# Altium schematic sheet yaokong.SchDoc
size A4
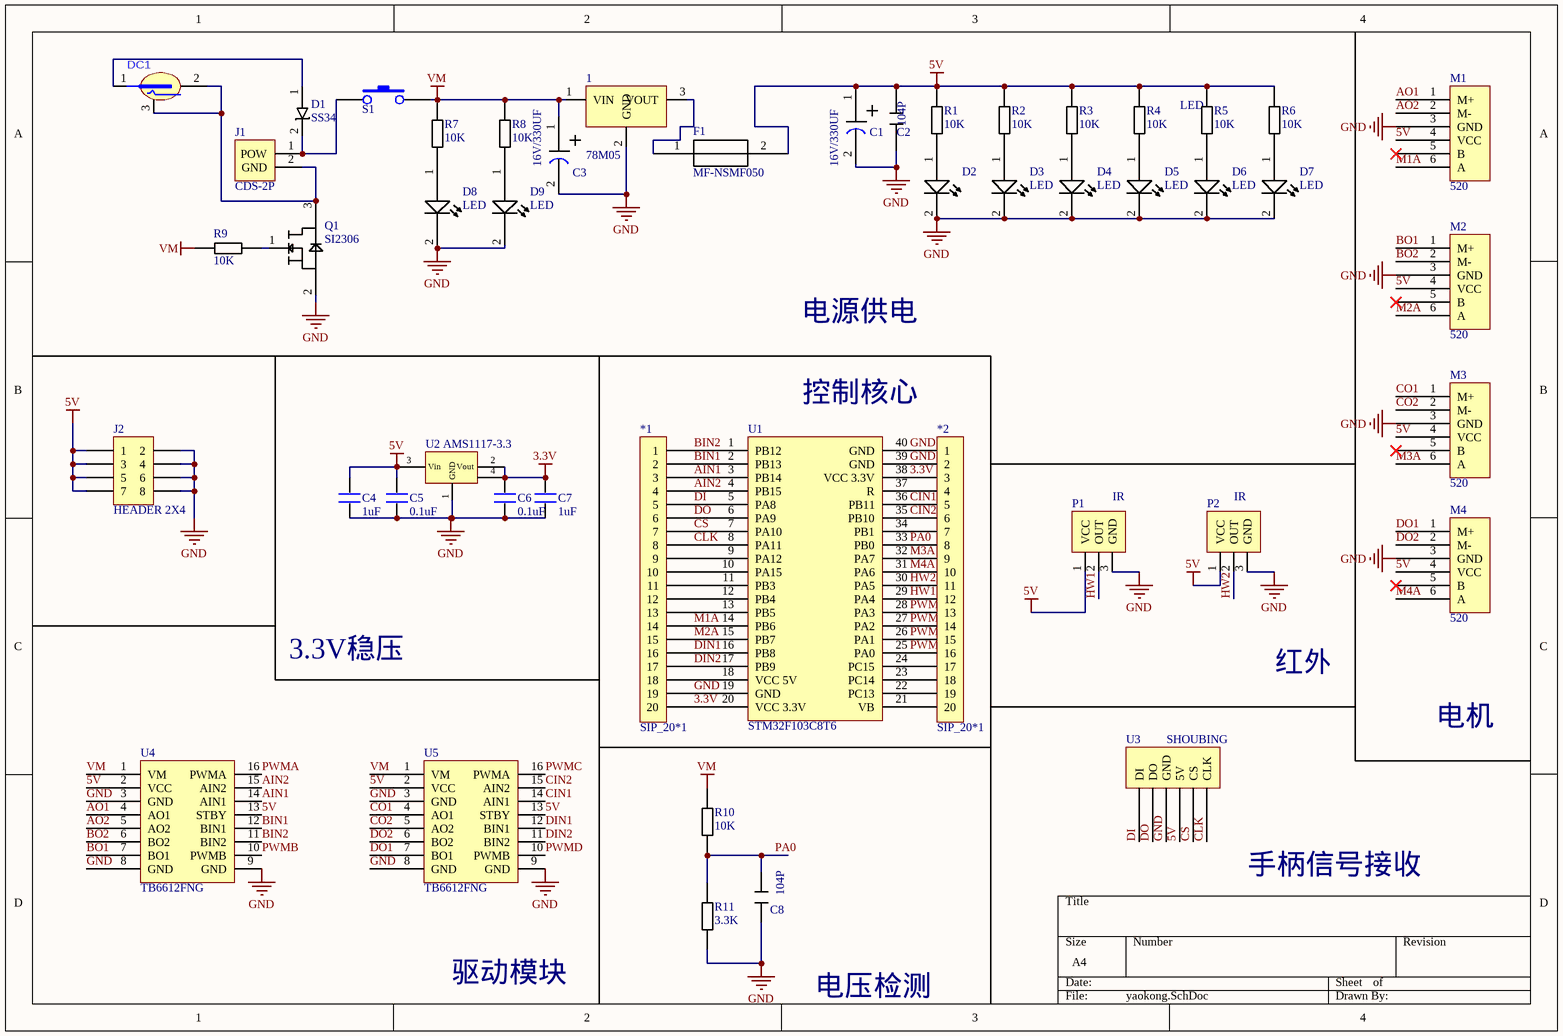
[diagram p0: yaokong.SchDoc]

## Parts
1  78M05  [78M05]
*1  SIP_20*1  [HEADER_20]
*2  SIP_20*1  [HEADER_20]
C1  16V/330UF  [ECAP]
C2  104P  [CAP]
C3  16V/330UF  [ECAP]
C4  1uF  [0603_棱丝印_2]
C5  0.1uF  [0603_棱丝印_2]
C6  0.1uF  [0603_棱丝印_2]
C7  1uF  [0603_棱丝印_2]
C8  104P  [CAP]
D1  SS34  [SS34]
D2  LED  [0603_棱丝印_2]
D3  LED  [0603_棱丝印_2]
D4  LED  [0603_棱丝印_2]
D5  LED  [0603_棱丝印_2]
D6  LED  [0603_棱丝印_2]
D7  LED  [0603_棱丝印_2]
D8  LED  [0603_棱丝印_2]
D9  LED  [0603_棱丝印_2]
DC1  DC005  [DC-IN_3P-DC-005-5A-3.0]  (value not drawn)
F1  MF-NSMF050  [MF]
J1  CDS-2P  [CDS-2P]
J2  HEADER 2X4  [HEADER2*4]
M1  520  [PH2.0-6P]
M2  520  [PH2.0-6P]
M3  520  [PH2.0-6P]
M4  520  [PH2.0-6P]
P1  IR  [HEADER3]
P2  IR  [HEADER3]
Q1  SI2306  [SI2306]
R1  10K  [0603_棱丝印_2]
R2  10K  [0603_棱丝印_2]
R3  10K  [0603_棱丝印_2]
R4  10K  [0603_棱丝印_2]
R5  10K  [0603_棱丝印_2]
R6  10K  [0603_棱丝印_2]
R7  10K  [0603_棱丝印_2]
R8  10K  [0603_棱丝印_2]
R9  10K  [0603_棱丝印_2]
R10  10K  [0603_棱丝印_2]
R11  3.3K  [0603_棱丝印_2]
S1  KEY  [KCD-11 2P]  (value not drawn)
U1  STM32F103C8T6  [STM32F103C8T6]
U2  AMS1117-3.3  [AMS1117-3.3]
U3  SHOUBING  [SHOUBING]
U4  TB6612FNG  [TB6612FNG]
U5  TB6612FNG  [TB6612FNG]

## Nets
3.3V: *1.20 *2.3 C6.2 C7.2 U1.20(VCC_3.3V) U1.38(VCC_3.3V) U2.2(Vout) U2.4(Vout)
5V: C1.1 C2.2 C4.2 C5.2 F1.2 J2.1 J2.3 J2.5 J2.7 M1.4(VCC) M2.4(VCC) M3.4(VCC) M4.4(VCC) P1.1(VCC) P2.1(VCC) R1.2 R2.2 R3.2 R4.2 R5.2 R6.2 U2.3(Vin) U3.4(5V) U4.2(VCC) U4.13(STBY) U5.2(VCC) U5.13(STBY)
GND: 1.2(GND) *1.19 *2.1 *2.2 C1.2 C2.1 C3.2 C4.1 C5.1 C6.1 C7.1 C8.1 D2.2 D3.2 D4.2 D5.2 D6.2 D7.2 D8.2 D9.2 J2.2 J2.4 J2.6 J2.8 M1.3(GND) M2.3(GND) M3.3(GND) M4.3(GND) P1.3(GND) P2.3(GND) Q1.2 R11.1 U1.19(GND) U1.39(GND) U1.40(GND) U2.1(GND) U3.3(GND) U4.3(GND) U4.8(GND) U4.9(GND) U5.3(GND) U5.8(GND) U5.9(GND)
VM: 1.1(VIN) C3.1 R7.2 R8.2 R9.1 R10.2 S1.2 U4.1(VM) U5.1(VM)
AIN1: *1.3 U1.3(PB14) U4.14(AIN1)
AIN2: *1.4 U1.4(PB15) U4.15(AIN2)
AO1: M1.1(M+) U4.4(AO1)
AO2: M1.2(M-) U4.5(AO2)
BIN1: *1.2 U1.2(PB13) U4.12(BIN1)
BIN2: *1.1 U1.1(PB12) U4.11(BIN2)
BO1: M2.1(M+) U4.7(BO1)
BO2: M2.2(M-) U4.6(BO2)
CIN1: *2.5 U1.36(PB11) U5.14(AIN1)
CIN2: *2.6 U1.35(PB10) U5.15(AIN2)
CLK: *1.8 U1.8(PA11) U3.6(CLK)
CO1: M3.1(M+) U5.4(AO1)
CO2: M3.2(M-) U5.5(AO2)
CS: *1.7 U1.7(PA10) U3.5(CS)
DI: *1.5 U1.5(PA8) U3.1(DI)
DIN1: *1.16 U1.16(PB8) U5.12(BIN1)
DIN2: *1.17 U1.17(PB9) U5.11(BIN2)
DO: *1.6 U1.6(PA9) U3.2(DO)
DO1: M4.1(M+) U5.7(BO1)
DO2: M4.2(M-) U5.6(BO2)
HW1: *2.12 P1.2(OUT) U1.29(PA4)
HW2: *2.11 P2.2(OUT) U1.30(PA5)
M1A: *1.14 M1.6(A) U1.14(PB6)
M2A: *1.15 M2.6(A) U1.15(PB7)
M3A: *2.9 M3.6(A) U1.32(PA7)
M4A: *2.10 M4.6(A) U1.31(PA6)
PA0: *2.8 C8.2 R10.1 R11.2 U1.33(PB0)
PWMA: *2.14 U1.27(PA2) U4.16(PWMA)
PWMB: *2.13 U1.28(PA3) U4.10(PWMB)
PWMC: *2.15 U1.26(PA1) U5.16(PWMA)
PWMD: *2.16 U1.25(PA0) U5.10(PWMB)
Net1_3: 1.3(VOUT) F1.1
Net*1_9: *1.9 U1.9(PA12)
Net*1_10: *1.10 U1.10(PA15)
Net*1_11: *1.11 U1.11(PB3)
Net*1_12: *1.12 U1.12(PB4)
Net*1_13: *1.13 U1.13(PB5)
Net*1_18: *1.18 U1.18(VCC_5V)
Net*2_4: *2.4 U1.37(R)
Net*2_7: *2.7 U1.34(PB1)
Net*2_17: *2.17 U1.24(PC15)
Net*2_18: *2.18 U1.23(PC14)
Net*2_19: *2.19 U1.22(PC13)
Net*2_20: *2.20 U1.21(VB)
NetD1_1: D1.1 DC1.1
NetD1_2: D1.2 J1.1(POW) S1.1
NetD2_1: D2.1 R1.1
NetD3_1: D3.1 R2.1
NetD4_1: D4.1 R3.1
NetD5_1: D5.1 R4.1
NetD6_1: D6.1 R5.1
NetD7_1: D7.1 R6.1
NetD8_1: D8.1 R7.1
NetD9_1: D9.1 R8.1
NetDC1_2: DC1.2 DC1.3 J1.2(GND) Q1.3
NetQ1_1: Q1.1 R9.2

Not connected (* = marked no-connect by the designer): M1 5(B)*; M2 5(B)*; M3 5(B)*; M4 5(B)*

## Notes on the sheet
- 电源供电
- (near U1) 控制核心
- 3.3V稳压
- 红外
- 电机
- 手柄信号接收
- 驱动模块
- 电压检测

## Library data of the parts
C1 C3 = ECAP
C2 C8 = CAP
C4-C7 = CAP: 无极性电容
DC1 = DC005: DC005电源接口
M1-M4 = dianji
R1-R11 = RES
U2 = AMS1117-3.3: 3.3V稳压